# EAGLE schematic STorM32 NT BGC v620-sd-010 (EAGLE 7.5.0)
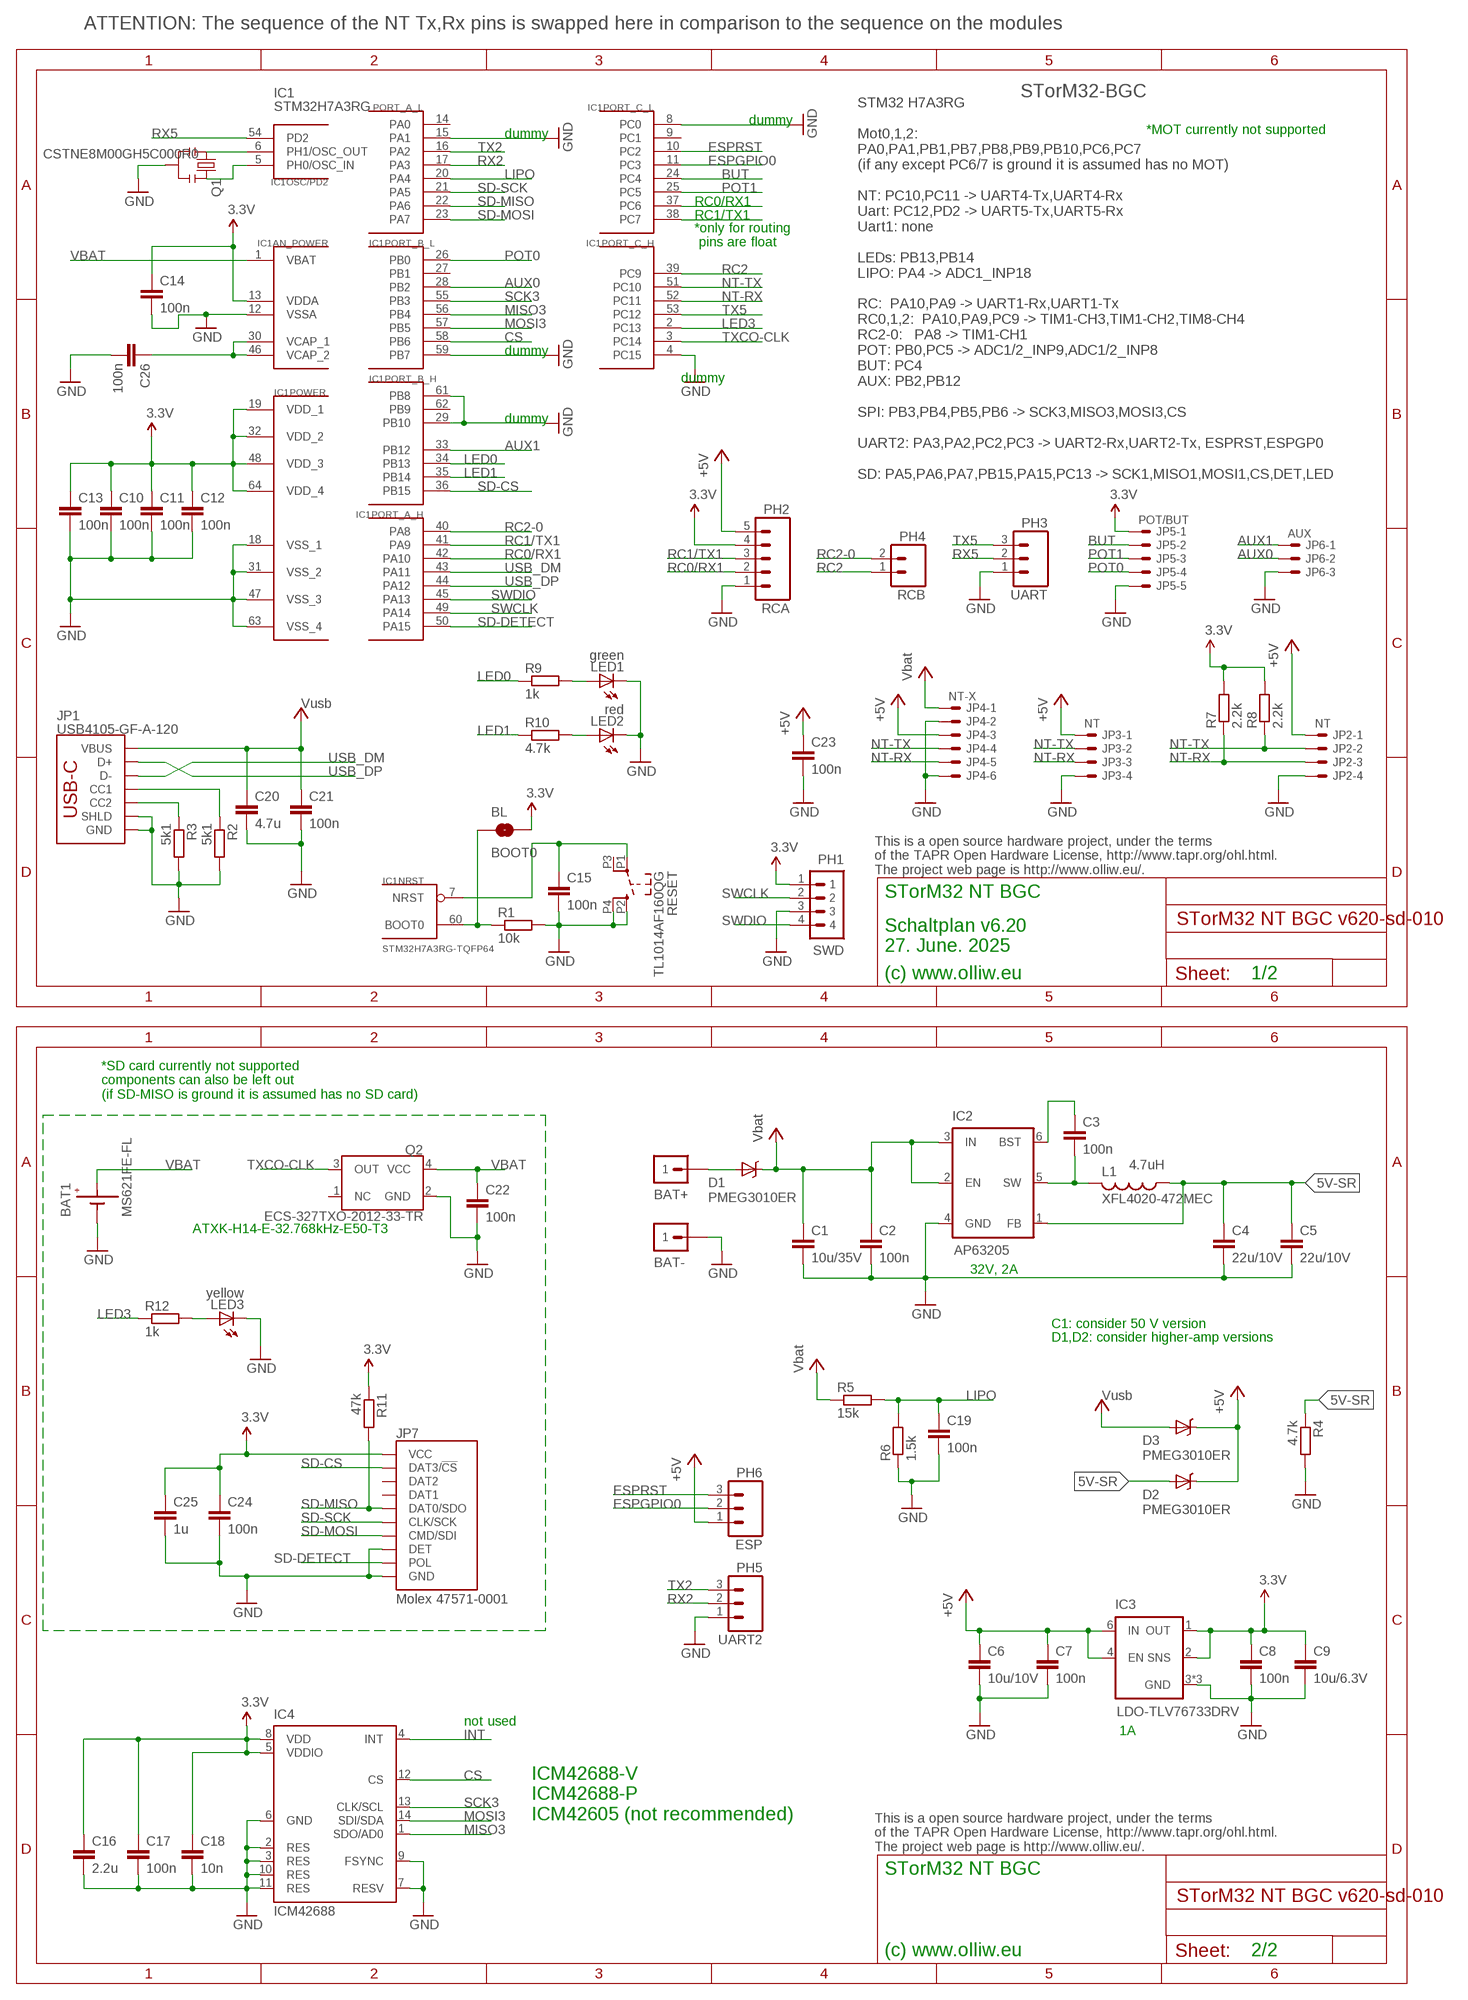
[diagram p0: schematic, sheet 1]

## Parts
BAT1  MS621FE-FL  CELL-SMD-6P8  [CELL-RECHARGABLE-6P8]
BAT+  M1X1  [1X1_WITHOUT]
BAT-  M1X1  [1X1_WITHOUT]
BL  BOOT0  SOLDERJUMPERNO  [SJ_2S-NO]
C1  10u/35V  C-EUC1206K  [C1206K]
C2  100n  C-EUC0603  [C0603]
C3  100n  C-EUC0402  [C0402]
C4  22u/10V  C-EUC0805K  [C0805K]
C5  22u/10V  C-EUC0805K  [C0805K]
C6  10u/10V  C-EUC0805K  [C0805K]
C7  100n  C-EUC0402  [C0402]
C8  100n  C-EUC0402  [C0402]
C9  10u/6.3V  C-EUC0805K  [C0805K]
C10  100n  C-EUC0402  [C0402]
C11  100n  C-EUC0402  [C0402]
C12  100n  C-EUC0402  [C0402]
C13  100n  C-EUC0402  [C0402]
C14  100n  C-EUC0402  [C0402]
C15  100n  C-EUC0402  [C0402]
C16  2.2u  C-EUC0603  [C0603]
C17  100n  C-EUC0402  [C0402]
C18  10n  C-EUC0402  [C0402]
C19  100n  C-EUC0402  [C0402]
C20  4.7u  C-EUC0603  [C0603]
C21  100n  C-EUC0402  [C0402]
C22  100n  C-EUC0402  [C0402]
C23  100n  C-EUC0402  [C0402]
C24  100n  C-EUC0402  [C0402]
C25  1u  C-EUC0402  [C0402]
C26  100n  C-EUC0402  [C0402]
D1  PMEG3010ER  DIODE-SCHOTTKYSOD123-W  [SOD123W-DIODE]
D2  PMEG3010ER  DIODE-SCHOTTKYSOD123-W  [SOD123W-DIODE]
D3  PMEG3010ER  DIODE-SCHOTTKYSOD123-W  [SOD123W-DIODE]
IC1  STM32H7A3RG-TQFP64  STM32H7A3-TQFP64  [TQFP64]
IC2  AP63205  [SOT23-6]
IC3  LDO-TLV76733DRV  LDO-TLV767  [WSON-6-2X2]
IC4  ICM42688  ICM42605  [LGA14-2.5X3]
JP1  USB4105-GF-A-120  USB-C  [USB-C]
JP2  NT  SM04B-SRSS-TB  [SM04B-SRSS-TB]
JP3  NT  SM04B-SRSS-TB  [SM04B-SRSS-TB]
JP4  NT-X  SM06B-SRSS-TB  [SM06B-SRSS-TB]
JP5  POT/BUT  SM05B-SRSS-TB  [SM05B-SRSS-TB]
JP6  AUX  SM03B-SRSS-TB  [SM03B-SRSS-TB]
JP7  Molex 47571-0001  SD-MICRO-DFT  [SD-MICRO-SHORT]
L1  XFL4020-472MEC  L  [L4X4]
LED1  green  LEDCHIPLED_0603  [CHIPLED_0603]
LED2  red  LEDCHIPLED_0603  [CHIPLED_0603]
LED3  yellow  LEDCHIPLED_0603  [CHIPLED_0603]
PH1  SWD  P4X1_1P27-OCT_BILEX  [4X1_1P27_OCT_BILEX]
PH2  RCA  M05PTH  [1X05]
PH3  UART  M031X03_NO_SILK  [1X03_NO_SILK]
PH4  RCB  M021X02_NO_SILK  [1X02_NO_SILK]
PH5  UART2  M031X03_NO_SILK  [1X03_NO_SILK]
PH6  ESP  M031X03_NO_SILK  [1X03_NO_SILK]
Q1  CSTNE8M00GH5C000R0  RESONATORSMD  [RESONATOR-SMD]
Q2  ECS-327TXO-2012-33-TR  TXCO-2.0X1.2MM  [TXCO-20X12]
R1  10k  R-EU_R0402  [R0402]
R2  5k1  R-EU_R0402  [R0402]
R3  5k1  R-EU_R0402  [R0402]
R4  4.7k  R-EU_R0402  [R0402]
R5  15k  R-EU_R0402  [R0402]
R6  1.5k  R-EU_R0402  [R0402]
R7  2.2k  R-EU_R0402  [R0402]
R8  2.2k  R-EU_R0402  [R0402]
R9  1k  R-EU_R0402  [R0402]
R10  4.7k  R-EU_R0402  [R0402]
R11  47k  R-EU_R0402  [R0402]
R12  1k  R-EU_R0402  [R0402]
RESET  TL1014AF160QG  SWITCH-SMD-RIGHT-TL1014  [TACTILE-SWITCH-SMD-RIGHT-TL1014]

## Nets
3.3V: BL.2 C8.1 C9.1 C10.1 C11.1 C12.1 C13.1 C14.1 C16.1 C17.1 C18.1 C24.1 C25.1 IC1.13(AN_POWER:VDDA) IC1.19(POWER:VDD_1) IC1.32(POWER:VDD_2) IC1.48(POWER:VDD_3) IC1.64(POWER:VDD_4) IC3.1(OUT) IC3.2(SNS) IC4.5(VDDIO) IC4.8(VDD) JP5.1 JP7.4(VCC) PH1.1 PH2.4 R7.2 R8.2 R11.1
5V-SR: C4.1 C5.1 D2.A IC2.1(FB) L1.1 R4.1
+5V: C6.1 C7.1 C23.1 D2.C D3.C IC3.4(EN) IC3.6(IN) JP2.1 JP3.1 JP4.3 PH2.5 PH6.1
AUX0: IC1.28(PORT_B_L:PB2) JP6.2
AUX1: IC1.33(PORT_B_H:PB12) JP6.1
BATP: BAT+.1 D1.A
BOOT0: BL.1 IC1.60(NRST:BOOT0) R1.1
BUT: IC1.24(PORT_C_L:PC4) JP5.2
CS: IC1.58(PORT_B_L:PB6) IC4.12(CS)
ESPGPIO0: IC1.11(PORT_C_L:PC3) PH6.2
ESPRST: IC1.10(PORT_C_L:PC2) PH6.3
GND: BAT1.P-(GND) BAT-.1 C1.2 C2.2 C4.2 C5.2 C6.2 C7.2 C8.2 C9.2 C10.2 C11.2 C12.2 C13.2 C14.2 C15.2 C16.2 C17.2 C18.2 C19.2 C20.2 C21.2 C22.2 C23.2 C24.2 C25.2 C26.2 IC1.4(PORT_C_H:PC15) IC1.8(PORT_C_L:PC0) IC1.12(AN_POWER:VSSA) IC1.15(PORT_A_L:PA1) IC1.18(POWER:VSS_1) IC1.29(PORT_B_H:PB10) IC1.31(POWER:VSS_2) IC1.47(POWER:VSS_3) IC1.59(PORT_B_L:PB7) IC1.61(PORT_B_H:PB8) IC1.63(POWER:VSS_4) IC2.4(GND) IC3.3(GND) IC3.5(GND) IC3.7(GND) IC4.2(RES) IC4.3(RES) IC4.6(GND) IC4.7(RESV) IC4.9(FSYNC) IC4.10(RES) IC4.11(RES) JP1.GND JP1.GND2(GND) JP1.SHLD1(SHLD) JP1.SHLD2(SHLD) JP1.SHLD3(SHLD) JP1.SHLD4(SHLD) JP2.4 JP3.4 JP4.2 JP4.6 JP5.5 JP6.3 JP7.6(GND) JP7.G4(DET) JP7.GND1(GND) JP7.GND2(GND) LED1.C LED2.C LED3.C PH1.3 PH2.1 PH3.1 PH5.1 Q1.2 Q2.2(GND) R1.2 R2.2 R3.2 R4.2 R6.1 RESET.P2 RESET.P4
INT: IC4.4(INT)
LED0: IC1.34(PORT_B_H:PB13) R9.1
LED1: IC1.35(PORT_B_H:PB14) R10.1
LED3: IC1.2(PORT_C_H:PC13) R12.1
LIPO: C19.1 IC1.20(PORT_A_L:PA4) R5.2 R6.2
MISO3: IC1.56(PORT_B_L:PB4) IC4.1(SDO/AD0)
MOSI3: IC1.57(PORT_B_L:PB5) IC4.14(SDI/SDA)
N$3: IC1.5(OSC/PD2:PH0/OSC_IN) Q1.3
N$4: LED3.A R12.2
N$8: LED1.A R9.2
N$9: LED2.A R10.2
N$10: JP1.A5(CC1) R2.1
N$11: JP1.B5(CC2) R3.1
N$12: IC1.6(OSC/PD2:PH1/OSC_OUT) Q1.1
N$13: C3.1 IC2.6(BST)
N$15: C3.2 IC2.5(SW) L1.2
NRST: C15.1 IC1.7(NRST:NRST) RESET.P1
NT-RX: IC1.52(PORT_C_H:PC11) JP2.3 JP3.3 JP4.5 R7.1
NT-TX: IC1.51(PORT_C_H:PC10) JP2.2 JP3.2 JP4.4 R8.1
POT0: IC1.26(PORT_B_L:PB0) JP5.4
POT1: IC1.25(PORT_C_L:PC5) JP5.3
RC0/RX1: IC1.37(PORT_C_L:PC6) IC1.42(PORT_A_H:PA10) PH2.2
RC1/TX1: IC1.38(PORT_C_L:PC7) IC1.41(PORT_A_H:PA9) PH2.3
RC2: IC1.39(PORT_C_H:PC9) PH4.1
RC2-0: IC1.40(PORT_A_H:PA8) PH4.2
RX2: IC1.17(PORT_A_L:PA3) PH5.2
RX5: IC1.54(OSC/PD2:PD2) PH3.2
SCK3: IC1.55(PORT_B_L:PB3) IC4.13(CLK/SCL)
SD-CS: IC1.36(PORT_B_H:PB15) JP7.2(DAT3/!CS!)
SD-DETECT: IC1.50(PORT_A_H:PA15) JP7.G3(POL)
SD-MISO: IC1.22(PORT_A_L:PA6) JP7.7(DAT0/SDO) R11.2
SD-MOSI: IC1.23(PORT_A_L:PA7) JP7.3(CMD/SDI)
SD-SCK: IC1.21(PORT_A_L:PA5) JP7.5(CLK/SCK)
SWCLK: IC1.49(PORT_A_H:PA14) PH1.2
SWDIO: IC1.45(PORT_A_H:PA13) PH1.4
TX2: IC1.16(PORT_A_L:PA2) PH5.3
TX5: IC1.53(PORT_C_H:PC12) PH3.3
TXCO-CLK: IC1.3(PORT_C_H:PC14) Q2.3(OUT)
USB_DM: IC1.43(PORT_A_H:PA11) JP1.A7(D-) JP1.B7(D-)
USB_DP: IC1.44(PORT_A_H:PA12) JP1.A6(D+) JP1.B6(D+)
VBAT: BAT1.P+(BAT+) C22.1 IC1.1(AN_POWER:VBAT) Q2.4(VCC)
VCAP_1: C26.1 IC1.30(AN_POWER:VCAP_1) IC1.46(AN_POWER:VCAP_2)
VCC: C1.1 C2.1 D1.C IC2.2(EN) IC2.3(IN) JP4.1 R5.1 ; supply symbol labelled Vbat
VUSB: C20.1 C21.1 D3.A JP1.VBUS1(VBUS) JP1.VBUS2(VBUS) ; supply symbol labelled Vusb
Unconnected: IC1.9(PORT_C_L:PC1) IC1.14(PORT_A_L:PA0) IC1.27(PORT_B_L:PB1) IC1.62(PORT_B_H:PB9) JP7.1(DAT2) JP7.8(DAT1) Q2.1(NC) RESET.P3

## Notes on the sheet
- ATTENTION: The sequence of the NT Tx,Rx pins is swapped here in comparison to the sequence on the modules
- IC1
- STM32 H7A3RG
  
  Mot0,1,2:
  PA0,PA1,PB1,PB7,PB8,PB9,PB10,PC6,PC7
  (if any except PC6/7 is ground it is assumed has no MOT)
  
  NT: PC10,PC11 -> UART4-Tx,UART4-Rx
  Uart: PC12,PD2 -> UART5-Tx,UART5-Rx
  Uart1: none
  
  LEDs: PB13,PB14
  LIPO: PA4 -> ADC1_INP18
  
  RC:  PA10,PA9 -> UART1-Rx,UART1-Tx
  RC0,1,2:  PA10,PA9,PC9 -> TIM1-CH3,TIM1-CH2,TIM8-CH4
  RC2-0:   PA8 -> TIM1-CH1
  POT: PB0,PC5 -> ADC1/2_INP9,ADC1/2_INP8
  BUT: PC4
  AUX: PB2,PB12
  
  SPI: PB3,PB4,PB5,PB6 -> SCK3,MISO3,MOSI3,CS
  
  UART2: PA3,PA2,PC2,PC3 -> UART2-Rx,UART2-Tx, ESPRST,ESPGP0
  
  SD: PA5,PA6,PA7,PB15,PA15,PC13 -> SCK1,MISO1,MOSI1,CS,DET,LED
- STorM32-BGC
- STM32H7A3RG
- dummy | *MOT currently not supported
- dummy
- *only for routing
   pins are float
- dummy
- dummy
- dummy
- This is a open source hardware project, under the terms
  of the TAPR Open Hardware License, http://www.tapr.org/ohl.html.
  The project web page is http://www.olliw.eu/.
- STorM32 NT BGC
- Schaltplan v6.20
  27. June. 2025
- (c) www.olliw.eu | 1/2
- *SD card currently not supported
   components can also be left out
   (if SD-MISO is ground it is assumed has no SD card)
- 4.7uH
- ATXK-H14-E-32.768kHz-E50-T3
- 32V, 2A
- C1: consider 50 V version
- D1,D2: consider higher-amp versions
- not used | 1A
- ICM42688-V
  ICM42688-P
  ICM42605 (not recommended)
- This is a open source hardware project, under the terms
  of the TAPR Open Hardware License, http://www.tapr.org/ohl.html.
  The project web page is http://www.olliw.eu/.
- STorM32 NT BGC
- (c) www.olliw.eu | 2/2

## Library data of the parts
BAT1 = # stdlib:CELL
BAT+ BAT- = # stdlib:M1X1
BL = # SparkFun2:SOLDERJUMPER: Solder Jumper Standard SMD solder jumper. Used to automate production. Two varients : Normally Open and Normally Closed are the same, but have different paste layers. NC will have a large amount of paste and should jumper during reflow.
C1-C26 = rcl:C-EU: CAPACITOR, European symbol
D1-D3 = # stdlib:DIODE-SCHOTTKY
IC1 = # stm32:STM32H7A3
IC2 = # stdlib:AP63205
IC3 = # stdlib:LDO-TLV767
IC4 = # stdlib:ICM42605
JP1 = # stdlib:USB
JP2 JP3 = con-jst2:?M04B-SRSS-TB: Disconnectable Crimp style connector, 1.0mm pitch 4 contacts
JP4 = con-jst2:?M06B-SRSS-TB: Disconnectable Crimp style connector, 1.0mm pitch 6 contacts
JP5 = con-jst2:?M05B-SRSS-TB: Disconnectable Crimp style connector, 1.0mm pitch 5 contacts
JP6 = con-jst2:?M03B-SRSS-TB: Disconnectable Crimp style connector, 1.0mm pitch 3 contacts
JP7 = # stdlib:SD-MICRO
L1 = # stdlib:L
LED1-LED3 = led:LED: LED OSRAM: - CHIPLED LG R971, LG N971, LY N971, LG Q971, LY Q971, LO R971, LY R971 LH N974, LH R974 LS Q976, LO Q976, LY Q976 LO Q996 - Hyper CHIPLED LW Q18S LB Q993, LB Q99A, LB R99A - SideLED LS A670, LO A670, LY A670, LG A670, LP A670 LB A673, LV A673, LT A673, LW A673 LH A674 LY A675 LS A676, LA A676, LO A676, LY A676, LW A676 LS A679, LY A679, LG A679 - Hyper Micro SIDELED® LS Y876, LA Y876, LO Y876, LY Y876 LT Y87S - SmartLED LW L88C, LW L88S LB L89C, LB L89S, LG L890 LS L89K, LO L89K, LY L89K LS L896, LA L896, LO L896, LY L896 - TOPLED LS T670, LO T670, LY T670, LG T670, LP T670 LSG T670, LSP T670, LSY T670, LOP T670, LYG T670 LG T671, LOG T671, LSG T671 LB T673, LV T673, LT T673, LW T673 LH T674 LS T676, LA T676, LO T676, LY T676, LB T676, LH T676, LSB T676, LW T676 LB T67C, LV T67C, LT T67C, LS T67K, LO T67K, LY T67K, LW E67C LS E67B, LA E67B, LO E67B, LY E67B, LB E67C, LV E67C, LT E67C LW T67C LS T679, LY T679, LG T679 LS T770, LO T770, LY T770, LG T770, LP T770 LB T773, LV T773, LT T773, LW T773 LH T774 LS E675, LA E675, LY E675, LS T675 LS T776, LA T776, LO T776, LY T776, LB T776 LHGB T686 LT T68C, LB T68C - Hyper Mini TOPLED® LB M676 - Mini TOPLED Santana® LG M470 LS M47K, LO M47K, LY M47K Source: http://www.osram.convergy.de LUXEON: - LUMILED® LXK2-PW12-R00, LXK2-PW12-S00, LXK2-PW14-U00, LXK2-PW14-V00 LXK2-PM12-R00, LXK2-PM12-S00, LXK2-PM14-U00 LXK2-PE12-Q00, LXK2-PE12-R00, LXK2-PE12-S00, LXK2-PE14-T00, LXK2-PE14-U00 LXK2-PB12-K00, LXK2-PB12-L00, LXK2-PB12-M00, LXK2-PB14-N00, LXK2-PB14-P00, LXK2-PB14-Q00 LXK2-PR12-L00, LXK2-PR12-M00, LXK2-PR14-Q00, LXK2-PR14-R00 LXK2-PD12-Q00, LXK2-PD12-R00, LXK2-PD12-S00 LXK2-PH12-R00, LXK2-PH12-S00 LXK2-PL12-P00, LXK2-PL12-Q00, LXK2-PL12-R00 Source: www.luxeon.com KINGBRIGHT: KA-3528ASYC Source: www.kingbright.com
PH1 = # stdlib:P4X1_1P27
PH2 = # SparkFun2:M05: Header 5 Standard 5-pin 0.1" header. Use with straight break away headers (SKU : PRT-00116), right angle break away headers (PRT-00553), swiss pins (PRT-00743), machine pins (PRT-00117), and female headers (PRT-00115). Molex polarized connector foot print use with SKU : PRT-08230 with associated crimp pins and housings.
PH3 PH5 PH6 = # SparkFun2:M03: Header 3 Standard 3-pin 0.1" header. Use with straight break away headers (SKU : PRT-00116), right angle break away headers (PRT-00553), swiss pins (PRT-00743), machine pins (PRT-00117), and female headers (PRT-00115). Molex polarized connector foot print use with SKU : PRT-08232 with associated crimp pins and housings.
PH4 = # SparkFun2:M02: Header 2 Standard 2-pin 0.1" header. Use with straight break away headers (SKU : PRT-00116), right angle break away headers (PRT-00553), swiss pins (PRT-00743), machine pins (PRT-00117), and female headers (PRT-00115). Molex polarized connector foot print use with SKU : PRT-08233 with associated crimp pins and housings.
Q1 = # SparkFun2:RESONATOR: Resonator Small SMD resonator. This is the itty bitty 10/20MHz resonators with built in caps. CSTCE10M0G55 and CSTCE20M0V53. Footprint has been reviewed closely but hasn't been tested yet.
Q2 = # stdlib:TXCO
R1-R12 = rcl:R-EU_: RESISTOR, European symbol
RESET = # stdlib:SWITCH-SMD-RIGHT-TL1014